# EAGLE board Progetto16sens (EAGLE 9.6.2)
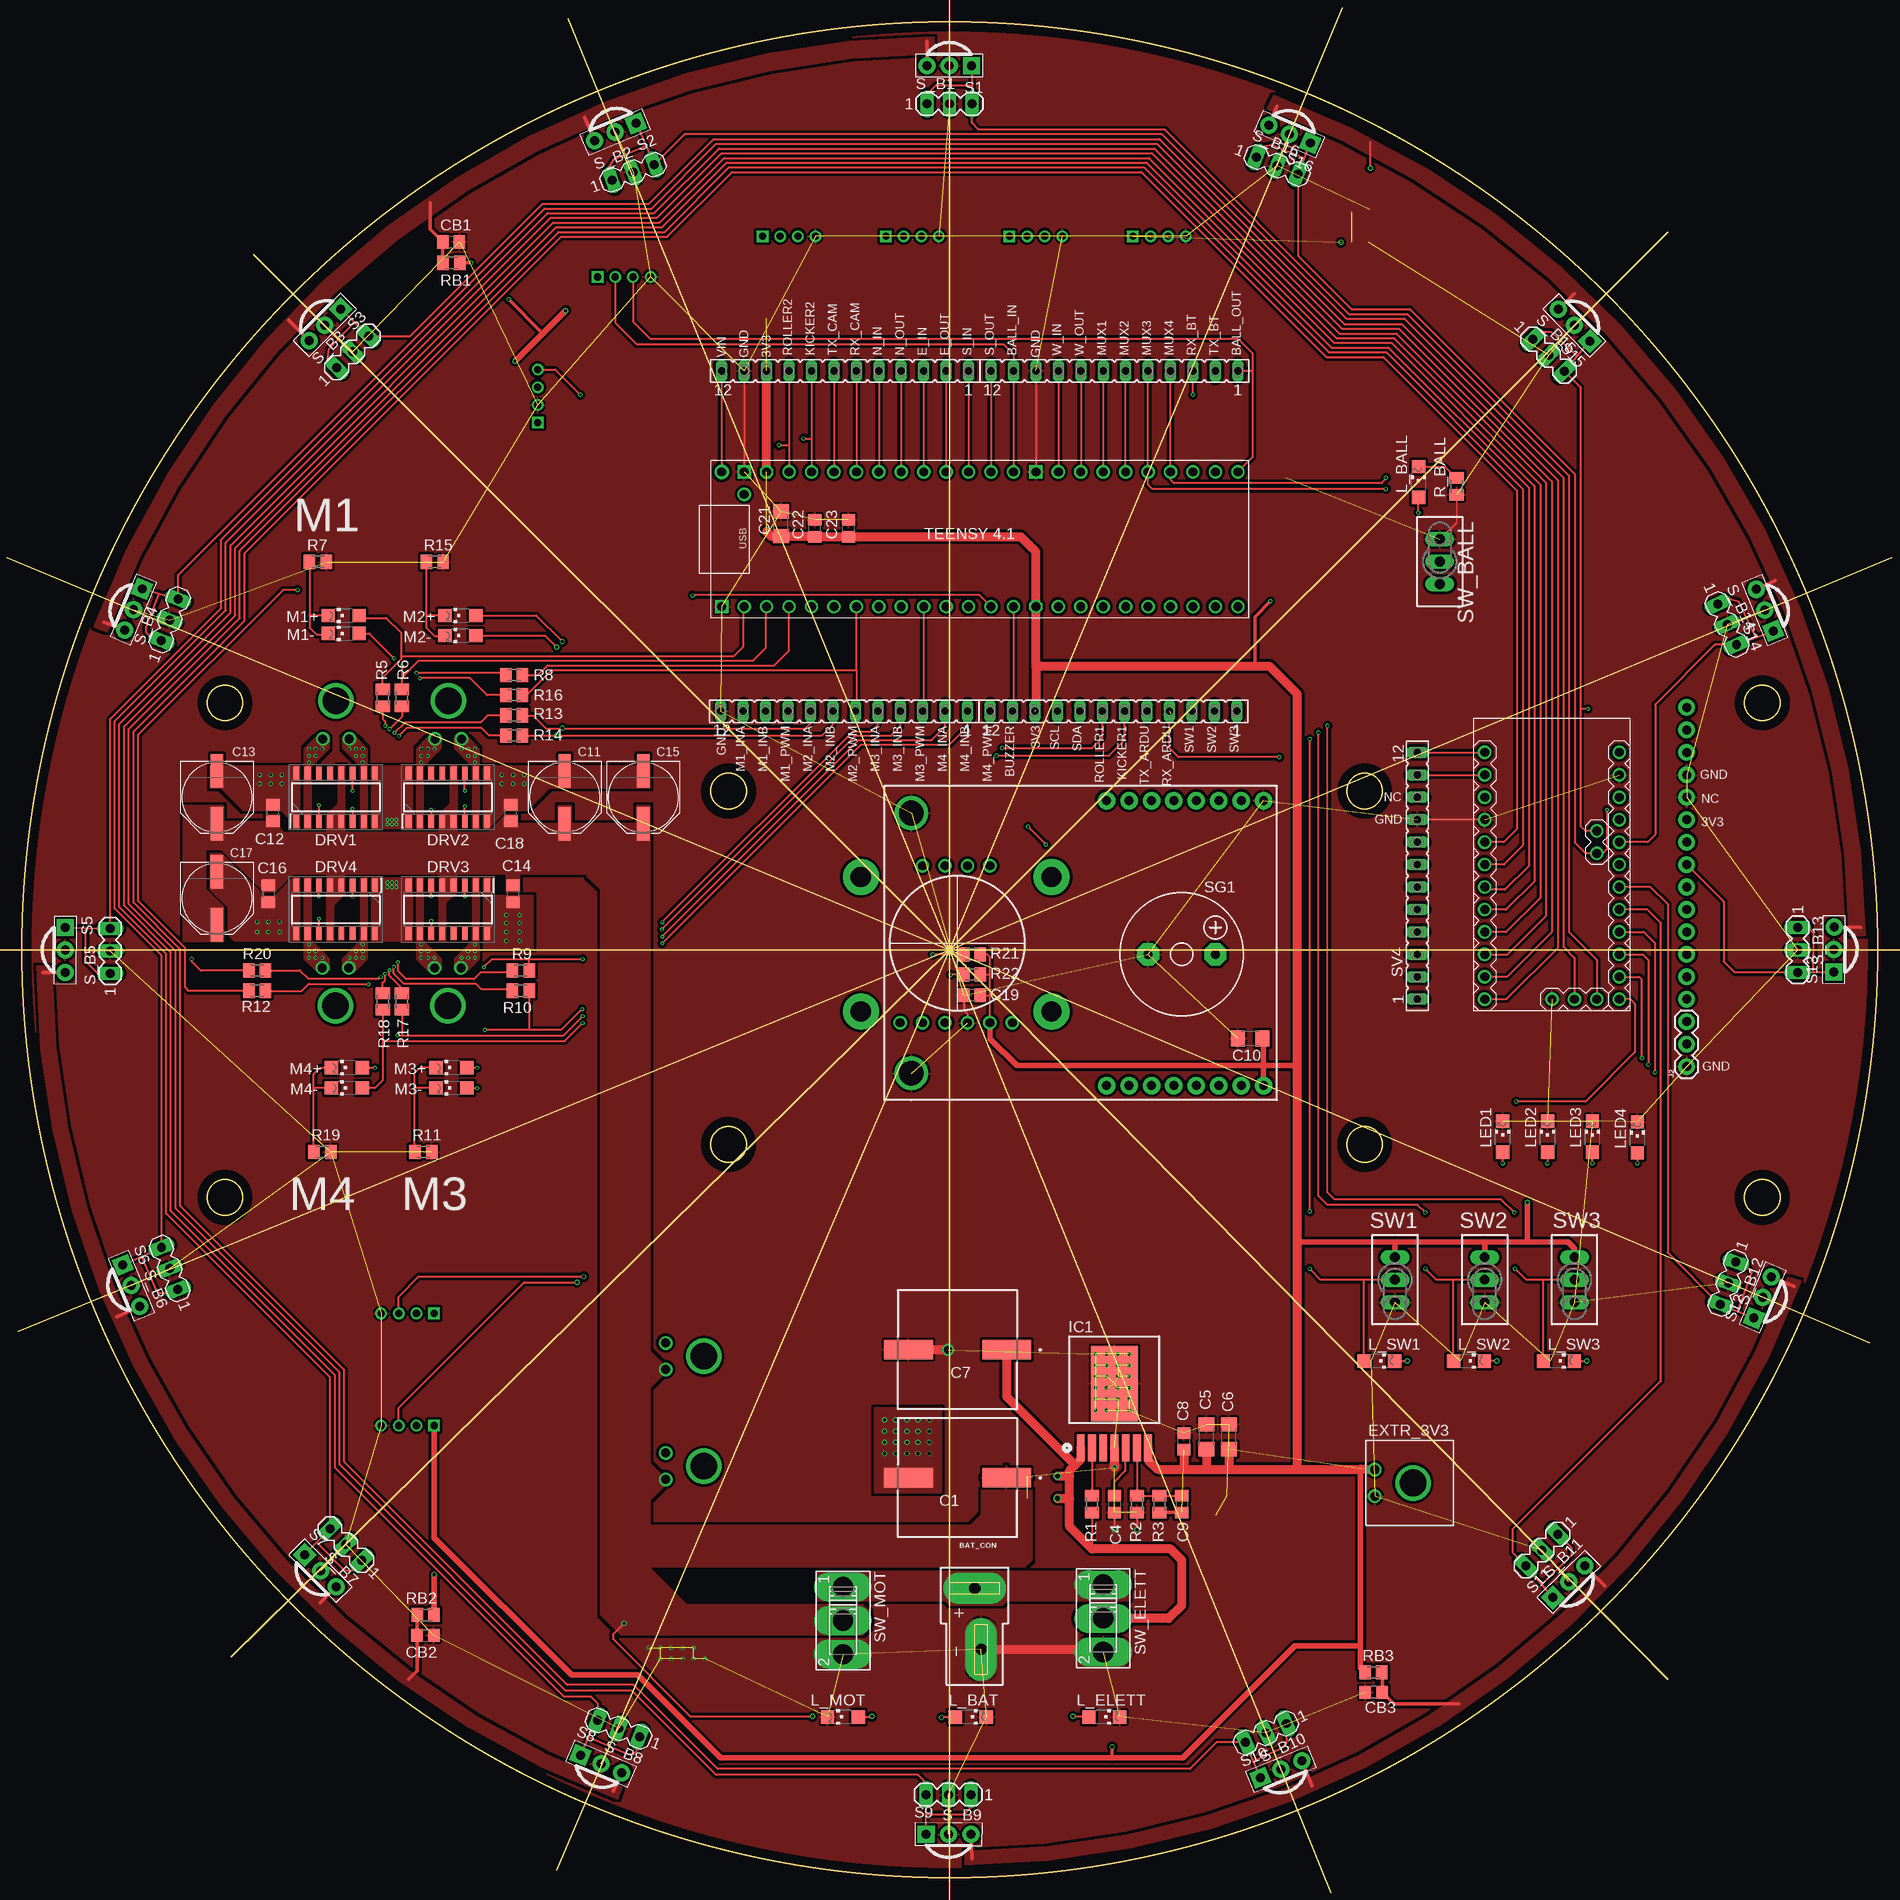
[diagram p2: board, top side]
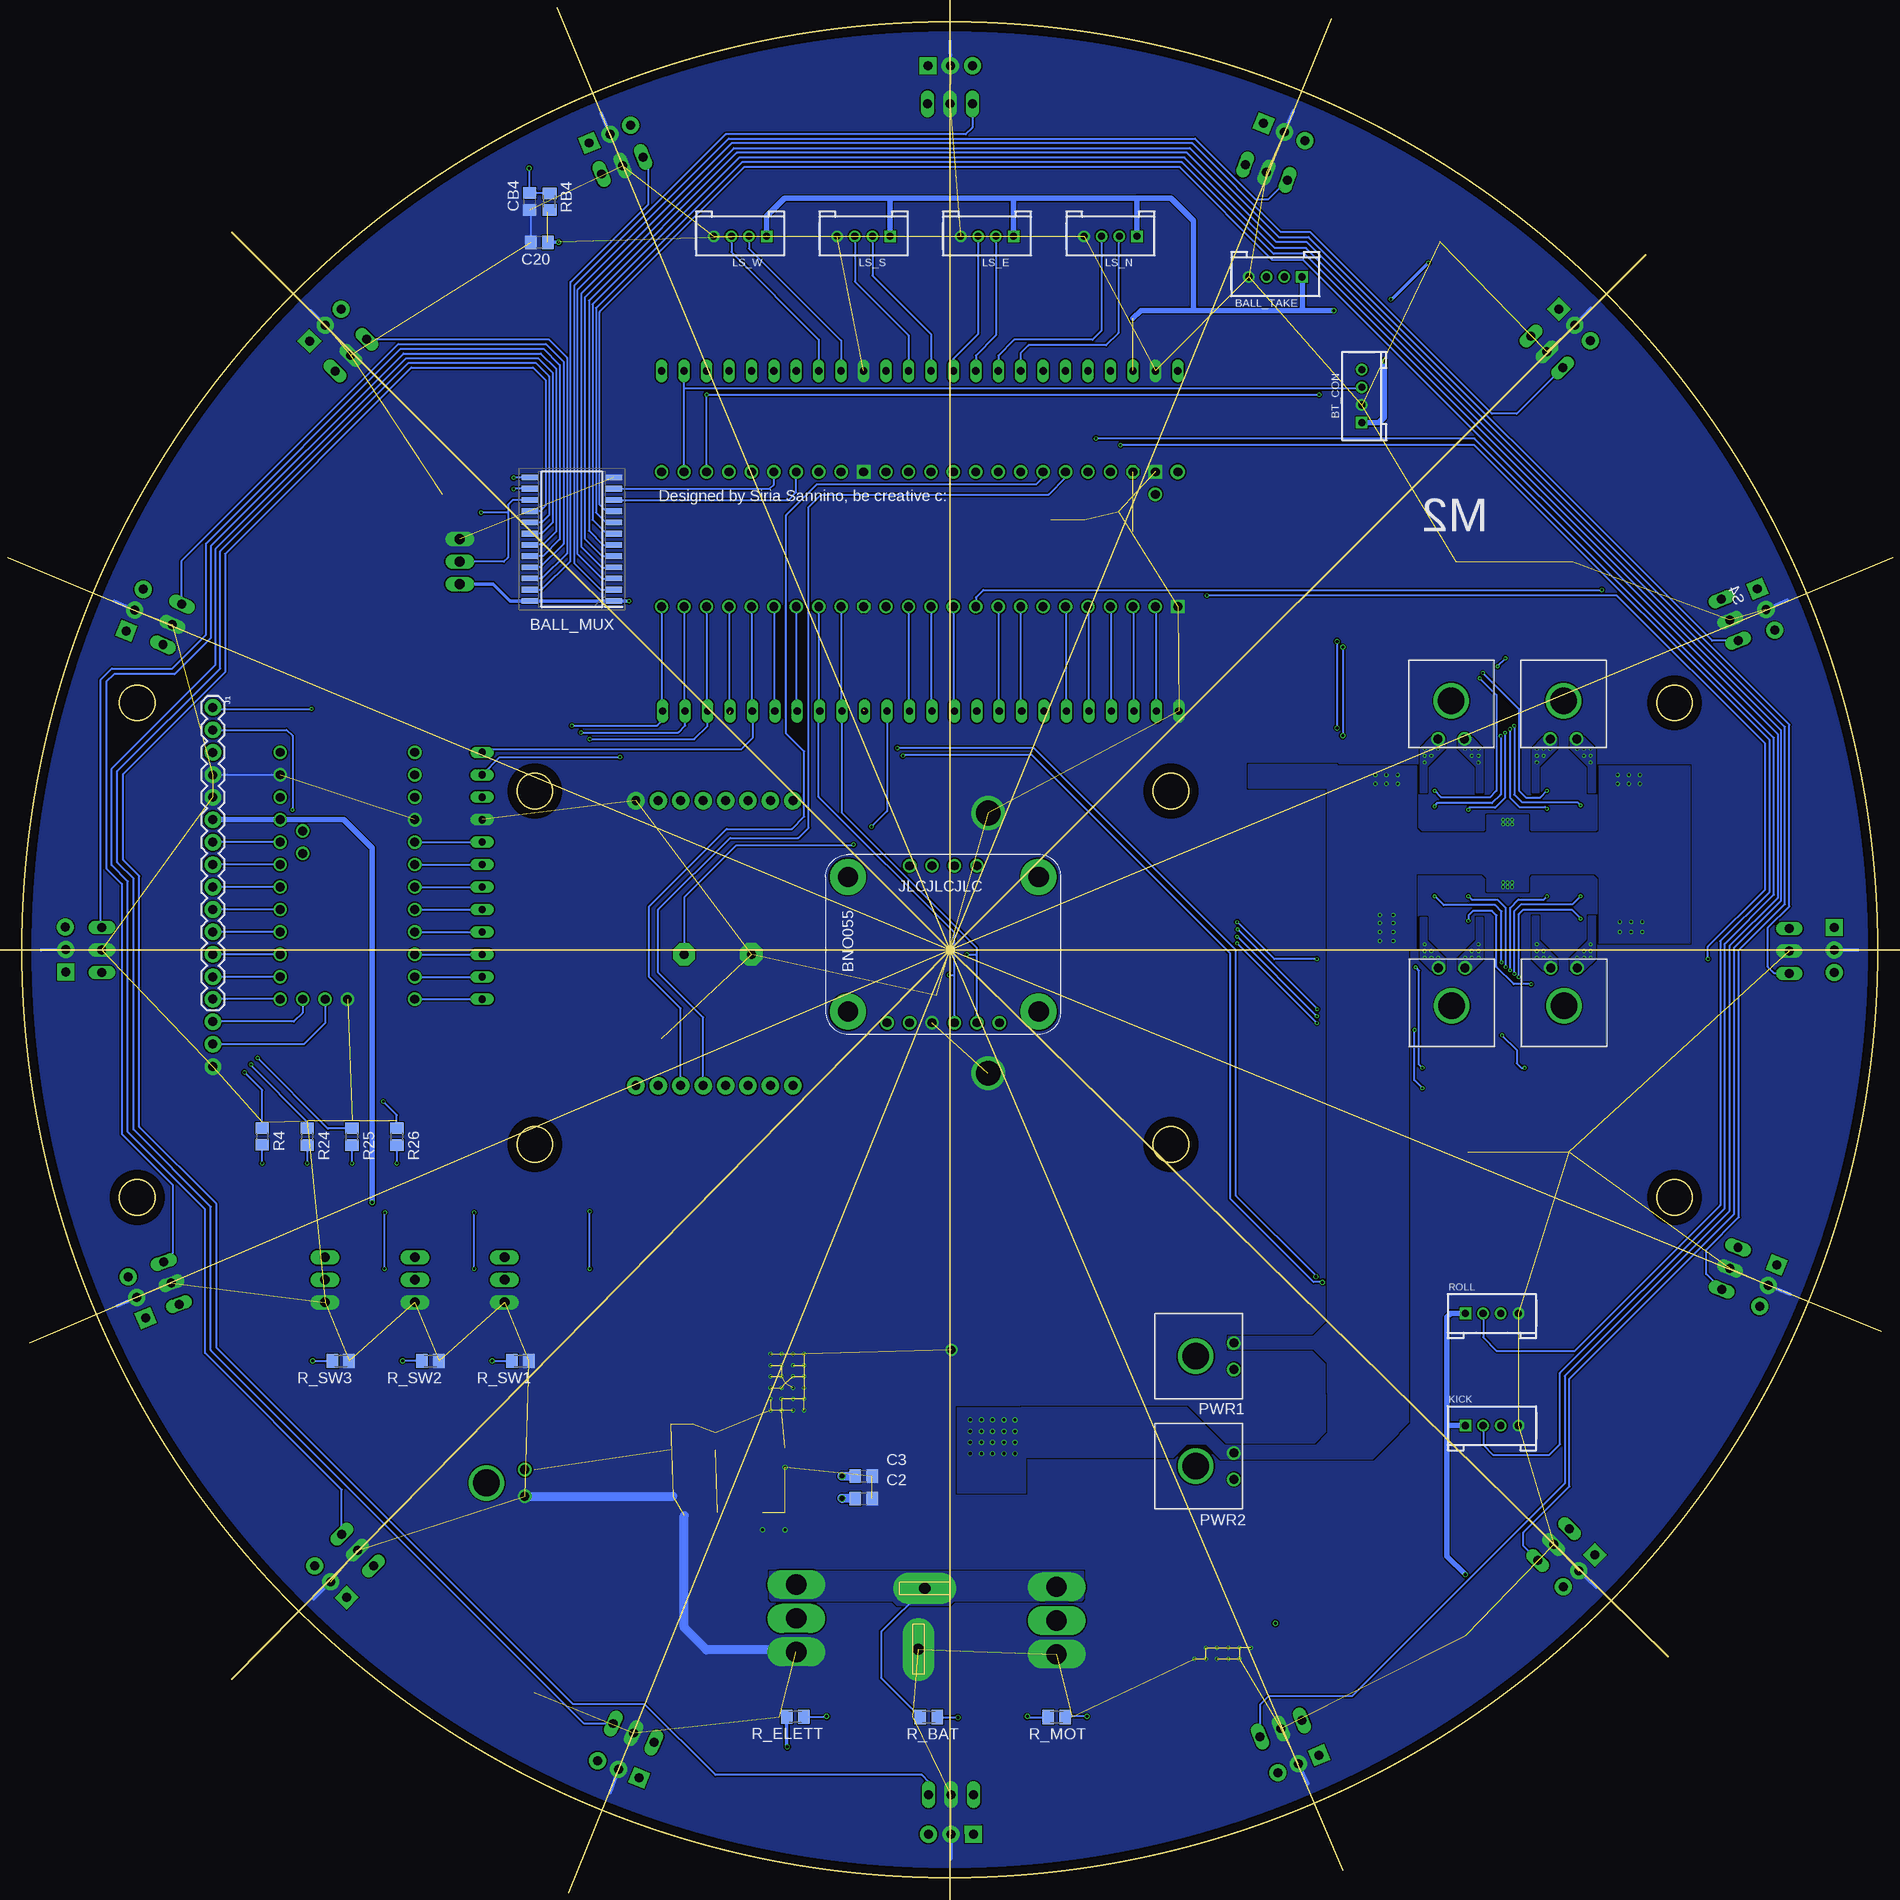
[diagram p3: board, bottom side, seen from below]

Size 210 x 210 mm. Coordinates in mm from the lower left corner, seen from the top.
Outline: circle at 105,105 radius 105
Outline: circle at 22.97,132.96 radius 2
Outline: circle at 22.97,76.96 radius 2
Outline: circle at 196.97,76.96 radius 2
Outline: circle at 196.97,132.96 radius 2
Outline: circle at 79.97,122.96 radius 2
Outline: circle at 79.97,82.96 radius 2
Outline: circle at 151.97,82.96 radius 2
Outline: circle at 151.97,122.96 radius 2
Copper layers (1*16): Top 0.035mm / dielectric 1.5mm / Bottom 0.035mm
Design rules "default *": minimum track width 6mil, minimum drill 0.35mm, track to track 6mil, track to pad 6mil, pad to pad 6mil, via to via 6mil, smd to smd 6mil, copper to edge 40mil, drill to drill 6mil, minimum pad ring 10mil, minimum via ring 4mil, stop-mask expansion 4mil, vias tented up to drill 0mil, thermal gap 10mil
Milling: 16 lines

## Footprints (pad centres in the part's own frame; a part is rotated, then mirrored left to right if it is on the bottom)
SOIC127P1030X265-24N = smd 1.95 x 0.65: 1 -4.725,6.985; 2 -4.725,5.715; 3 -4.725,4.445; 4 -4.725,3.175; 5 -4.725,1.905; 6 -4.725,0.635; 7 -4.725,-0.635; 8 -4.725,-1.905; 9 -4.725,-3.175; 10 -4.725,-4.445; 11 -4.725,-5.715; 12 -4.725,-6.985; 13 4.725,-6.985; 14 4.725,-5.715; 15 4.725,-4.445; 16 4.725,-3.175; 17 4.725,-1.905; 18 4.725,-0.635; 19 4.725,0.635; 20 4.725,1.905; 21 4.725,3.175; 22 4.725,4.445; 23 4.725,5.715; 24 4.725,6.985
HW4-2.0 = drill 0.8 pad 1.27 square: 1 -3,0 | drill 0.8 pad 1.27: 2 -1,0; 3 1,0; 4 3,0
DEANS = drill 1.27 pad 3.556 long: + 0,0; - 0.737,-6.921
FKV(H13) = smd 5.5 x 2.2: 1 -5.55,0; 2 5.55,0
C0805 = smd 1.3 x 1.5: 1 -0.95,0; 2 0.95,0
C1206 = smd 1.6 x 1.8: 1 -1.4,0; 2 1.4,0
PANASONIC_E = smd 3.8 x 1.4: + 3,0; - -3,0
SOIC127P600X175-16N = smd 1.525 x 0.65: 1 -2.712,4.445; 2 -2.712,3.175; 3 -2.712,1.905; 4 -2.712,0.635; 5 -2.712,-0.635; 6 -2.712,-1.905; 7 -2.712,-3.175; 8 -2.712,-4.445; 9 2.712,-4.445; 10 2.712,-3.175; 11 2.712,-1.905; 12 2.712,-0.635; 13 2.712,0.635; 14 2.712,1.905; 15 2.712,3.175; 16 2.712,4.445
43650-0200 = drill 1.02 pad 1.52: 1 0,0; 2 -3,0 | drill 3 pad 3: 3 -1.5,-4.32
NDW0007A = smd 0.89 x 3.06: 1 -3.81,0; 2 -2.54,0; 3 -1.27,0; 4 0,0; 5 1.27,0; 6 2.54,0; 7 3.81,0 | smd 5.35 x 8.54: 8 0,7.305
1X14 = drill 1.016 pad 1.88: 1 0,0; 2 2.54,0; 3 5.08,0; 4 7.62,0; 5 10.16,0; 6 12.7,0; 7 15.24,0; 8 17.78,0; 9 20.32,0; 10 22.86,0; 11 25.4,0; 12 27.94,0; 13 30.48,0; 14 33.02,0
1X03 = drill 1.016 pad 1.88: 1 0,0; 2 2.54,0; 3 5.08,0
2.0_1X4 = drill 0.8 pad 1.27 square: 1 -3,0 | drill 0.8 pad 1.27: 2 -1,0; 3 1,0; 4 3,0
CHIPLED_1206 = smd 1.5 x 1.5: A 0,-1.75; C 0,1.75
ARDUINO-PRO-MINI#NP = drill 1: J2.1 -1.27,5.08; J2.2 -3.81,5.08; J3.1 15.24,0; J3.2 15.24,2.54; J3.3 15.24,5.08; J6.1 -12.7,7.62; J6.2 -10.16,7.62; J6.3 -7.62,7.62; J6.4 -5.08,7.62; J6.5 -2.54,7.62; J6.6 0,7.62; J6.7 2.54,7.62; J6.8 5.08,7.62; J6.9 7.62,7.62; J6.10 10.16,7.62; J6.11 12.7,7.62; J6.12 15.24,7.62; J7.1 15.24,-7.62; J7.2 12.7,-7.62; J7.3 10.16,-7.62; J7.4 7.62,-7.62; J7.5 5.08,-7.62; J7.6 2.54,-7.62; J7.7 0,-7.62; J7.8 -2.54,-7.62; J7.9 -5.08,-7.62; J7.10 -7.62,-7.62; J7.11 -10.16,-7.62; J7.12 -12.7,-7.62
M0805 = smd 1.3 x 1.6: 1 -0.95,0; 2 0.95,0
R0805 = smd 1.3 x 1.5: 1 -0.95,0; 2 0.95,0
PNA460XM = drill 1.016 pad 1.93 square: 1 -2.54,0 | drill 1.016 pad 1.93: 2 0,0; 3 2.54,0
MA03-1 = drill 1.016 long: 1 -2.54,0; 2 0,0; 3 2.54,0
F/CM12P = drill 1.016 pad 2.54 octagon: + 3.81,0; - -3.81,0
FE12 = drill 0.813 long: 1 -13.97,0; 2 -11.43,0; 3 -8.89,0; 4 -6.35,0; 5 -3.81,0; 6 -1.27,0; 7 1.27,0; 8 3.81,0; 9 6.35,0; 10 8.89,0; 11 11.43,0; 12 13.97,0
TL3XPO = drill 1.1 pad 1.422 long: 1 -2.54,0; 2 0,0; 3 2.54,0
255SB = drill 2.286 pad 3.175 long: 1 -3.81,0; 2 0,0; 3 3.81,0
TEENSY41_EDIT = drill 1: 0/RX1 -25.4,-7.62; 1/TX1 -22.86,-7.62; 2 -20.32,-7.62; 3 -17.78,-7.62; 4 -15.24,-7.62; 5 -12.7,-7.62; 6 -10.16,-7.62; 7/RX2 -7.62,-7.62; 8/TX2 -5.08,-7.62; 9 -2.54,-7.62; 10/CS 0,-7.62; 11/MOSI 2.54,-7.62; 12/MISO 5.08,-7.62; 13(LED)/SCK 5.08,7.62; 14/A0/TX3 2.54,7.62; 15/A1/RX3 0,7.62; 16/A2/RX4/SCL1 -2.54,7.62; 17/A3/TX4/SDA1 -5.08,7.62; 18/A4/SDA -7.62,7.62; 19/A5/SCL -10.16,7.62; 20/A6/TX5 -12.7,7.62; 21/A7/RX5 -15.24,7.62; 22/A8 -17.78,7.62; 23/A9 -20.32,7.62; 24/A10/TX6/SCL2 10.16,-7.62; 25/A11/RX6/SDA2 12.7,-7.62; 26/A12/MOSI1 15.24,-7.62; 27/A13/SCK1 17.78,-7.62; 28/RX7 20.32,-7.62; 29/TX7 22.86,-7.62; 30 25.4,-7.62; 31 27.94,-7.62; 32 30.48,-7.62; 33 30.48,7.62; 34/RX8 27.94,7.62; 35/TX8 25.4,7.62; 36/CS 22.86,7.62; 37/CS 20.32,7.62; 38/A14/(CS1) 17.78,7.62; 39/A15/(MISO1) 15.24,7.62; 40/A16 12.7,7.62; 41/A17 10.16,7.62; VUSB -25.4,5.08 | drill 1 octagon: 3V3 7.62,-7.62; 3V3_1 -22.86,7.62 | drill 1 square: GND -27.94,-7.62; GND_1 7.62,7.62; GND_2 -25.4,7.62 | drill 1 pad 1.676: VIN -27.94,7.62
OPENMV_H7 = drill 1.016 pad 1.981: 3V3 1.651,1.524; BOOT 33.909,16.764; GND 33.909,1.524; P0 1.651,19.304; P1 1.651,16.764; P2 1.651,14.224; P3 1.651,11.684; P4 1.651,9.144; P5 1.651,6.604; P6 1.651,4.064; P7 33.909,6.604; P8 33.909,9.144; P9 33.909,11.684; RST 33.909,19.304; SYNC 33.909,14.224; VIN 33.909,4.064 | drill 2.794 pad 3.81: PAD1 3.048,41.402 | drill 2.794: PAD2 32.512,41.402
BNO055_BNO055 = drill 1: 3V3 9.525,1.27; ADR 17.145,19.05; GND 12.065,1.27; INT 14.605,19.05; PS0 9.525,19.05; PS1 12.065,19.05; RST 19.685,1.27; SCL 17.145,1.27; SDA 14.605,1.27; VIN 6.985,1.27 | drill 2.286 pad 4.064: PAD@1 2.54,17.78; PAD@2 24.13,17.78; PAD@3 2.54,2.54; PAD@4 24.13,2.54

## Placement (x,y rotation side)
BALL_MUX  CD74HC4067M  [SOIC127P1030X265-24N]  147.77,151.47 180 bottom
BALL_TAKE  4P-2.0  [HW4-2.0]  68.14,181.16 180 bottom
BAT_CON  [DEANS]  107.82,32.73 0 top
BT_CON  4P-2.0  [HW4-2.0]  58.36,167.67 90 bottom
C1  EEV-FK1C152Q  [FKV(H13)]  105.88,45.26 180 top
C2  100n  [C0805]  114.72,42.88 0 bottom
C3  100n  [C0805]  114.72,45.42 0 bottom
C4  22n  [C0805]  123.64,42.25 270 top
C5  100u  [C1206]  134.05,49.87 90 top
C6  100u  [C1206]  136.59,49.87 90 top
C7  EEV-FK1C152Q  [FKV(H13)]  105.88,59.74 180 top
C8  100n  [C0805]  131.51,49.36 90 top
C9  22n  [C0805]  131.26,42.25 270 top
C10  100u  [C1206]  139.01,94.95 180 top
C11  [PANASONIC_E]  61.41,122.26 270 top
C12  [C0805]  28.39,120.48 90 top
C13  [PANASONIC_E]  22.04,122.26 270 top
C14  [C0805]  55.57,111.34 270 top
C15  [PANASONIC_E]  70.3,122.26 270 top
C16  [C0805]  27.88,111.34 270 top
C17  [PANASONIC_E]  22.04,110.83 270 top
C18  [C0805]  55.31,120.48 90 top
C19  1u  [C0805]  107.51,99.85 180 top
C20  1u  [C0805]  151.45,185.07 180 bottom
C21  [C1206]  85.92,153.22 90 top
C22  [C0805]  89.73,152.71 90 top
C23  [C0805]  93.54,152.71 90 top
CB1  [C0805]  48.57,185.12 0 top
CB2  [C0805]  45.65,27.39 0 top
CB3  [C0805]  152.99,20.94 180 top
CB4  [C0805]  152.57,189.71 270 bottom
DRV1  VNH7070ASTR  [SOIC127P600X175-16N]  35.5,122.26 90 top
DRV2  VNH7070ASTR  [SOIC127P600X175-16N]  48.2,122.26 90 top
DRV3  VNH7070ASTR  [SOIC127P600X175-16N]  48.2,109.56 270 top
DRV4  VNH7070ASTR  [SOIC127P600X175-16N]  35.5,109.56 270 top
EXTR_3V3  43650-0201  [43650-0200]  153.1,46.16 90 top
IC1  LMZ14202TZE-ADJ_NOPB  [NDW0007A]  123.64,48.6 0 top
J1  [1X14]  188.41,132.42 270 bottom
J2  455-1750-1-ND  [1X03]  188.41,91.78 90 top
KICK  TWIG_2.0  [2.0_1X4]  43.63,51.14 0 bottom
L_BALL  [CHIPLED_1206]  158.06,157.95 0 top
L_BAT  [CHIPLED_1206]  107.38,18.16 270 top
L_ELETT  [CHIPLED_1206]  122.5,18.16 270 top
L_MOT  [CHIPLED_1206]  92.91,18.16 90 top
L_SW1  [CHIPLED_1206]  153.61,58.45 270 top
L_SW2  [CHIPLED_1206]  163.77,58.45 270 top
L_SW3  [CHIPLED_1206]  173.93,58.45 270 top
LED1  [CHIPLED_1206]  167.58,83.85 0 top
LED2  [CHIPLED_1206]  172.66,83.85 0 top
LED3  [CHIPLED_1206]  177.74,83.85 0 top
LED4  [CHIPLED_1206]  182.82,83.75 0 top
LS_E  4P-2.0  [HW4-2.0]  100.78,185.76 180 bottom
LS_N  4P-2.0  [HW4-2.0]  86.81,185.76 180 bottom
LS_S  4P-2.0  [HW4-2.0]  114.75,185.76 180 bottom
LS_W  4P-2.0  [HW4-2.0]  128.72,185.76 180 bottom
M1  43650-0201  [43650-0200]  37.03,128.86 180 bottom
M1+  [CHIPLED_1206]  36.39,142.83 90 top
M1-  [CHIPLED_1206]  36.39,140.8 90 top
M2  43650-0201  [43650-0200]  49.73,128.86 180 bottom
M2+  [CHIPLED_1206]  49.6,142.83 90 top
M2-  [CHIPLED_1206]  49.6,140.55 90 top
M3  43650-0201  [43650-0200]  46.68,102.96 0 bottom
M3+  [CHIPLED_1206]  48.58,91.65 90 top
M3-  [CHIPLED_1206]  48.58,89.37 90 top
M4  43650-0201  [43650-0200]  33.98,102.96 0 bottom
M4+  [CHIPLED_1206]  36.77,91.65 90 top
M4-  [CHIPLED_1206]  36.77,89.37 90 top
M5  ARDUINO-PRO-MINI  [ARDUINO-PRO-MINI#NP]  173.17,114.64 270 top
PWR1  43650-0201  [43650-0200]  72.84,57.49 270 bottom
PWR2  43650-0201  [43650-0200]  72.84,45.04 270 bottom
R1  61,9k  [M0805]  121.1,42.25 90 top
R2  1,07k  [M0805]  126.18,42.25 90 top
R3  3,32k  [M0805]  128.72,42.25 90 top
R4  [R0805]  182.82,83.88 270 bottom
R5  [M0805]  40.84,133.5 270 top
R6  [M0805]  43,133.5 270 top
R7  [M0805]  33.5,148.9 0 top
R8  [M0805]  55.7,136.1 0 top
R9  [M0805]  56.46,102.64 180 top
R10  [M0805]  56.46,100.36 180 top
R11  [M0805]  45.41,82.13 0 top
R12  [M0805]  26.61,100.36 180 top
R13  [M0805]  55.7,131.53 180 top
R14  [M0805]  55.7,129.25 180 top
R15  [M0805]  46.71,148.9 0 top
R16  [M0805]  55.7,133.82 0 top
R17  [M0805]  43,99.15 90 top
R18  [M0805]  40.84,99.15 90 top
R19  [M0805]  33.98,82.13 0 top
R20  [M0805]  26.61,102.64 180 top
R21  10k  [M0805]  107.51,104.48 0 top
R22  10k  [M0805]  107.51,102.19 0 top
R24  [R0805]  177.74,83.85 270 bottom
R25  [R0805]  172.66,83.85 270 bottom
R26  [R0805]  167.58,83.85 270 bottom
R_BALL  [M0805]  162.38,157.44 90 top
R_BAT  [M0805]  107.38,18.15 0 bottom
R_ELETT  [M0805]  122.5,18.19 180 bottom
R_MOT  [M0805]  92.91,18.15 0 bottom
R_SW1  [M0805]  153.61,58.45 180 bottom
R_SW2  [M0805]  163.77,58.45 180 bottom
R_SW3  [M0805]  173.93,58.45 180 bottom
RB1  [M0805]  48.6,182.74 180 top
RB2  [M0805]  45.68,29.71 180 top
RB3  [M0805]  152.96,23.2 0 top
RB4  [M0805]  150.31,189.68 90 bottom
ROLL  TWIG_2.0  [2.0_1X4]  43.63,63.84 0 bottom
S1  PNA460XM  [PNA460XM]  104.94,205.06 180 top
S2  PNA460XM  [PNA460XM]  67.13,197.56 202.5 top
S3  PNA460XM  [PNA460XM]  34.27,175.72 224.9 top
S4  PNA460XM  [PNA460XM]  12.61,143.51 247.4 top
S5  PNA460XM  [PNA460XM]  4.89,104.96 269.8 top
S6  PNA460XM  [PNA460XM]  12.37,66.98 292.3 top
S7  PNA460XM  [PNA460XM]  33.78,34.71 314.8 top
S8  PNA460XM  [PNA460XM]  65.53,12.85 337.2 top
S9  PNA460XM  [PNA460XM]  104.87,4.89 359.7 top
S10  PNA460XM  [PNA460XM]  142.5,12.23 22.2 top
S11  PNA460XM  [PNA460XM]  175.07,33.46 44.6 top
S12  PNA460XM  [PNA460XM]  197.01,65.64 67.1 top
S13  PNA460XM  [PNA460XM]  205.08,105.02 89.6 top
S14  PNA460XM  [PNA460XM]  197.25,143.44 112.1 top
S15  PNA460XM  [PNA460XM]  175.69,175.68 134.6 top
S16  PNA460XM  [PNA460XM]  143.46,197.31 157 top
S_B1  [MA03-1]  104.97,200.75 0 top
S_B2  [MA03-1]  69.16,193 20 top
S_B3  [MA03-1]  37.41,172.68 45 top
S_B4  [MA03-1]  16.71,142.33 68.2 top
S_B5  [MA03-1]  9.98,104.86 90 top
S_B6  [MA03-1]  16.71,68.92 111.5 top
S_B7  [MA03-1]  36.65,37.68 135 top
S_B8  [MA03-1]  67.51,16.85 158.5 top
S_B9  [MA03-1]  104.84,9.36 180 top
S_B10  [MA03-1]  140.78,16.34 205 top
S_B11  [MA03-1]  172.03,37.04 225 top
S_B12  [MA03-1]  193.11,67.27 250 top
S_B13  [MA03-1]  200.98,104.99 270 top
S_B14  [MA03-1]  192.98,141.82 295 top
S_B15  [MA03-1]  172.79,172.3 315 top
S_B16  [MA03-1]  142.06,193.76 338 top
SG1  F/CM12P  [F/CM12P]  131.26,104.48 0 top
SV1  [FE12]  93.05,132.01 180 top
SV2  [FE12]  123.53,132.01 180 top
SV3  [FE12]  123.64,170.52 180 top
SV4  [FE12]  157.93,113.37 90 top
SV6  [FE12]  93.16,170.52 180 top
SW1  TL32PO  [TL3XPO]  155.39,67.65 90 top
SW2  TL32PO  [TL3XPO]  165.55,67.65 90 top
SW3  TL32PO  [TL3XPO]  175.71,67.65 90 top
SW_BALL  TL38PO  [TL3XPO]  160.47,148.93 270 top
SW_ELETT  [255SB]  122.37,29.33 270 top
SW_MOT  [255SB]  92.91,29.07 270 top
U$1  TEENSY41_EDIT  [TEENSY41_EDIT]  107.13,151.47 0 top
U$2  OPENMV_H7  [OPENMV_H7]  142.06,87.97 90 top
U$3  BNO055_BNO055  [BNO055_BNO055]  119.07,95.46 0 bottom

## Tracks (layer width: path | path; a pad name or v marks a point on that pad's centre or on a via)
+3V3  (via drill 0.25, 0.35)  (7 unrouted)
  Top 0.254: U$3.3V3 109.54,99.75 | 109.54,99.75 109.54,102.17 | 109.54,102.17 109.54,104.2 109.26,104.48 R21.2 | R22.2 109.51,102.19 109.54,102.17 | C19.1 109.45,99.85 109.54,99.75
  Top 0.406: C9.2 R3.1 | v141.29,144.46 139.51,142.68 139.51,137.09 | RB1.1 v50.84,182.74 | RB2.1 46.64,29.72 | v55.06,178.62 58.87,174.81 58.87,174.68 | v123.39,14.79 123.39,13.52
  Top 0.61: C10.1 140.53,94.83 140.53,91.88 | U$3.3V3 109.54,94.93 112.59,91.88 140.53,91.88 | 140.53,91.88 U$2.3V3 | 140.53,91.88 143.96,91.88 144.34,92.26 | 144.34,71.94 155.39,71.94 | 155.39,71.94 165.55,71.94 | 165.55,71.94 170.38,71.94 | 170.38,71.94 174.95,71.94 175.71,71.18 SW3.3 | SW2.3 165.55,71.94 | SW1.3 155.39,71.94 | v170.38,76.38 170.38,71.94 | 151.5,46.19 151.5,26.22 | 151.5,26.22 151.5,23.71 RB3.1 | v46.64,34.28 46.64,29.72 | 151.5,26.22 144.09,26.22 131.39,13.52 123.39,13.52 79.06,13.52 69.67,22.92 62.17,22.92 46.63,38.46 KICK.1 | v55.82,171.63 58.87,174.68 v61.54,177.35
  Top 1.016: 131.5,46.19 128.55,46.19 127.45,47.28 IC1.7 | 131.5,46.19 134.06,46.19 | 134.06,46.19 136.59,46.19 | C8.1 131.51,46.2 131.5,46.19 | C5.1 134.05,46.19 134.06,46.19 | C6.1 136.59,46.19 | 136.59,46.19 144.34,46.19 | 144.34,46.19 151.5,46.19 | 151.96,46.19 153.07,46.19 EXTR_3V3.1 | 144.34,46.19 144.34,71.94 144.34,92.26 144.34,133.91 141.17,137.09 139.51,137.09 115.13,137.09 | 114.75,132.12 114.75,137.09 115.13,137.09 | 84.27,152.33 84.78,151.82 C21.1 89.67,151.82 C22.1 C23.1 113.03,151.76 113.99,150.81 114.75,150.04 U$1.3V3 114.75,137.47 115.13,137.09 | U$1.3V3_1 SV6.10
  Bottom 0.254: 150.5,188.54 RB4.1
  Bottom 0.406: SW_BALL.3 156.69,146.39 154.75,144.46 153.23,144.46 | 153.23,144.46 152.52,144.46 BALL_MUX.24 | v141.29,144.46 141.32,144.49 BALL_MUX.1 153.2,144.49 153.23,144.46 | C20.1 v149.27,185.07 | 46.64,51.13 KICK.1 | v50.84,182.74 54.96,178.62 v55.06,178.62 | R_ELETT.2 123.45,14.85 v123.39,14.79
  Bottom 0.61: v170.38,76.38 170.38,116.52 173.58,119.72 M5.J6.4 J1.6 | ROLL.1 48.3,63.84 48.71,63.43 48.71,51.14 | 48.71,51.14 48.71,36.34 v46.64,34.28 | KICK.1 48.71,51.14 | LS_W.1 125.72,188.05 123.72,190.05 111.7,190.05 | 111.7,190.05 97.86,190.05 | 97.86,190.05 83.89,190.05 | LS_E.1 97.78,189.97 97.86,190.05 | LS_S.1 111.75,190 111.7,190.05 | BALL_TAKE.1 65.09,181.11 65.09,177.35 | 65.09,177.35 77.41,177.35 | 77.41,177.35 77.41,187.51 79.95,190.05 83.89,190.05 | BT_CON.1 56.44,164.67 55.82,165.28 v55.82,171.63 | v61.54,177.35 65.09,177.35 | LS_N.1 83.81,189.97 83.89,190.05 | 77.41,177.35 83.38,177.35 84.27,176.46
+12V  (via drill 0.55)
  Top 0.254: R1.1 121.1,37.17
  Top 1.016: 119.2,46.7 118.56,46.06 118.56,45.44 | 119.2,46.7 119.83,47.33 IC1.1 | 118.56,42.88 118.56,39.71 121.1,37.17 129.99,37.17 131.26,35.9 131.26,30.82 129.77,29.33 SW_ELETT.2 | 118.56,42.88 118.56,45.44 | C7.1 111.43,54.46 119.2,46.7 | v117.2,45.42 117.21,45.44 118.56,45.44 | v117.2,42.91 117.23,42.88 118.56,42.88
  Bottom 1.016: C3.1 v117.2,45.42 | C2.1 117.17,42.88 v117.2,42.91
A_RX  (via drill 0.25)  (1 unrouted)
  Top 0.254: SV4.11 M5.J7.11 | SV2.4 129.86,131.99 129.86,127.82 130.88,126.8 v142.31,126.8
  Bottom 0.254: SV4.11 155.93,126.8 v142.31,126.8 | U$1.29/TX7 129.99,131.74
A_TX
  Top 0.254: SV4.12 M5.J7.12
  Bottom 0.254: SV2.5 127.34,131.63 | 127.34,131.63 127.34,128.94 128.56,127.72 157.55,127.72 SV4.12 | U$1.28/RX7 127.45,131.74 127.34,131.63
B1
  Top 0.254: M5.J3.3 178.25,103.82 175.07,106.99 175.07,158.68 156.79,176.97 150.18,176.97 129.33,197.82 108.27,197.82 107.51,198.58 107.51,200.21 | 107.51,200.21 S_B1.3 | S1.1 107.5,202.88 | 107.5,202.88 107.51,200.21 | S_B1.1 102.43,201.86 103.45,202.88 107.5,202.88
  Bottom 0.254: BALL_MUX.2 144.5,145.75 147.52,148.77 147.52,180.14 130.37,197.29 103.19,197.29 102.43,198.05 S_B1.1 | M5.J3.3 178.25,97.85 179.24,96.86 J2.3
B2
  Top 0.254: M5.J3.2 175.71,104.07 174.42,105.36 174.42,158.44 156.43,176.44 149.89,176.44 129.03,197.29 74.96,197.29 S_B2.3 70.61,195.99 | S2.1 70.61,195.99 | S_B2.1 66.36,193.48 67,194.49 70.61,195.99
  Bottom 0.254: BALL_MUX.3 143.07,147 144.34,147 147.11,149.76 147.11,179.72 130.03,196.81 77.24,196.81 70.39,189.95 68.95,189.95 S_B2.1 | M5.J3.2 175.71,96.7 178.12,94.29 188.38,94.29 J2.2
B3
  Top 0.254: M5.J7.1 168.03,99.4 173.82,105.2 173.82,158.16 156.15,175.82 149.68,175.82 128.75,196.75 78.28,196.75 70.96,189.44 58.9,189.44 43.93,174.48 S_B3.3 37.6,176.02 | S3.1 37.6,176.02 | S_B3.1 34.61,171.89 34.74,173.03 37.6,176.02
  Bottom 0.254: 157.27,99.4 SV4.1 M5.J7.1 | S_B3.1 40.83,165.67 43.63,165.67 64.2,186.24 67.51,186.24 77.54,196.27 129.71,196.27 146.7,179.28 146.7,150.63 144.34,148.27 143.07,148.27 BALL_MUX.4
B4
  Top 0.254: M5.J7.2 165.56,101.93 168.07,101.93 173.16,107.01 173.16,157.99 155.86,175.29 149.38,175.29 128.45,196.22 78.57,196.22 71.26,188.91 59.12,188.91 17.65,147.43 S_B4.3 15.5,145.3 | S4.1 15.5,145.3 | S_B4.1 14.42,140.52 14.04,140.9 14.04,141.53 15.5,145.3
  Bottom 0.254: S_B4.1 18.7,139.97 64.4,185.67 67.77,185.67 77.83,195.74 129.41,195.74 146.3,178.86 146.3,151.49 144.34,149.54 143.07,149.54 BALL_MUX.5 | M5.J7.2 SV4.2
B5
  Top 0.254: M5.J7.3 165.58,104.45 168.09,104.45 172.5,108.86 172.5,157.82 155.56,174.76 149.08,174.76 128.16,195.69 78.87,195.69 71.55,188.37 59.48,188.37 22.55,151.44 22.55,143.69 9.98,131.12 S_B5.3 7.18,107.45 | S5.1 7.18,107.45 | S_B5.1 9.88,102.42 8.45,102.42 7.18,103.69 7.18,107.45
  Bottom 0.254: S_B5.1 11.66,102.32 12.39,103.05 12.39,107.5 9.98,109.91 9.98,130.49 64.58,185.09 68.02,185.09 78.13,195.2 129.12,195.2 145.85,178.48 145.85,152.44 144.21,150.81 143.07,150.81 BALL_MUX.6 | M5.J7.3 SV4.3
B6
  Top 0.254: M5.J7.4 165.58,106.99 167.96,106.99 171.84,110.87 171.84,157.65 155.27,174.23 148.79,174.23 127.86,195.15 79.16,195.15 71.85,187.84 59.84,187.84 23.06,151.06 23.06,143.44 10.48,130.87 10.48,109.66 15.78,104.37 S_B6.3 13.53,70.28 | S6.1 13.53,70.28 | S_B6.1 16.45,66.1 15.56,66.1 15.18,66.48 13.53,70.28
  Bottom 0.254: S_B6.1 19.37,68.29 19.37,71.05 15.69,74.73 15.69,104.96 10.48,110.17 10.48,130.23 64.68,184.43 68.19,184.43 78.43,194.67 128.82,194.67 145.44,178.05 145.44,153.69 143.83,152.08 143.07,152.08 BALL_MUX.7 | M5.J7.4 SV4.4
B7
  Top 0.254: M5.J7.5 165.58,109.53 167.96,109.53 171.18,112.75 171.18,157.48 154.97,173.69 148.49,173.69 127.56,194.62 79.46,194.62 72.14,187.31 60.13,187.31 23.59,150.76 23.59,143.15 11.02,130.57 11.02,109.83 16.31,104.53 16.31,75.13 34.87,56.57 34.87,41.97 34.85,41.95 S_B7.3 33.33,37.91 | S7.1 33.33,37.91 | S_B7.1 37.29,34.73 36.52,34.73 33.33,37.91
  Bottom 0.254: S_B7.1 40.07,37.52 40.07,39.05 34.87,44.25 34.87,56.45 16.22,75.09 16.22,105.25 10.89,110.59 10.89,129.81 64.85,183.77 68.36,183.77 78.72,194.14 128.53,194.14 145.04,177.63 145.04,154.49 143.9,153.35 143.07,153.35 BALL_MUX.8 | M5.J7.5 SV4.5
B8
  Top 0.254: M5.J7.6 165.83,111.82 167.84,111.82 170.52,114.5 170.52,157.31 154.68,173.16 148.2,173.16 127.27,194.09 79.75,194.09 72.44,186.77 60.43,186.77 24.12,150.47 24.12,142.85 11.55,130.28 11.55,109.99 16.84,104.7 16.84,75.43 35.4,56.87 35.4,46.41 61.36,20.45 64.38,20.45 65.14,19.69 65.14,17.96 | 65.14,17.96 S_B8.3 | S8.1 64.14,15.84 | 64.14,15.84 64.26,16.09 65.14,17.96 | S_B8.1 69.79,15.84 69.79,14.53 69.16,13.9 68.65,13.9 64.14,15.84
  Bottom 0.254: BALL_MUX.9 143.9,154.65 144.63,155.38 144.63,177.21 128.23,193.61 79.02,193.61 68.52,183.11 65.02,183.11 11.3,129.39 11.3,110.88 16.76,105.42 16.76,75.38 35.4,56.74 35.4,44.61 59.51,20.5 68.9,20.5 69.87,19.54 S_B8.1 | M5.J7.6 SV4.6
B9
  Top 0.254: S_B9.3 102.3,9.58 | 102.3,9.58 102.3,10.73 101.42,11.61 78.56,11.61 69.03,21.14 61.54,21.14 35.93,46.74 35.93,57.16 17.38,75.72 17.38,104.86 12.08,110.16 12.08,129.98 24.66,142.55 24.66,150.17 60.72,186.24 72.73,186.24 80.05,193.55 126.97,193.55 147.9,172.62 154.4,172.62 169.86,157.16 169.86,116.77 167.73,114.64 M5.J7.7 | S9.1 102.32,7.17 | 102.32,7.17 102.3,9.58 | 102.32,7.17 106.62,7.17 107.38,7.93 S_B9.1
  Bottom 0.254: S_B9.1 107.38,10.85 108.15,11.61 131.51,11.61 139.51,19.62 147.64,19.62 187.98,59.96 187.98,76.21 196.72,84.95 196.72,113.34 198.55,115.17 198.55,124.91 187.04,136.42 187.04,149.8 165.94,170.89 152.18,170.89 150.77,169.48 150.77,155.25 151.37,154.65 BALL_MUX.16 | M5.J7.7 SV4.7
B10
  Top 0.254: M5.J7.8 167.71,117.18 169.2,118.67 169.2,157 154.1,172.09 147.61,172.09 126.68,193.02 80.34,193.02 73.03,185.71 61.02,185.71 25.19,149.88 25.19,142.26 12.62,129.69 12.62,110.33 17.91,105.03 17.91,76.02 36.47,57.46 36.47,47.04 61.71,21.8 69.2,21.8 78.72,12.27 132.19,12.27 135.18,15.27 S_B10.3 139.39,13.14 | S_B10.1 143.09,15.19 142.44,14.53 139.39,13.14 | S10.1 139.39,13.14
  Bottom 0.254: S_B10.1 146.39,17.42 188.64,59.66 188.64,75.92 197.38,84.66 197.38,113.04 199.21,114.88 199.21,125.2 187.57,136.84 187.57,150.09 166.24,171.43 151.89,171.43 150.36,169.9 150.36,154.18 151.2,153.35 152.47,153.35 BALL_MUX.17 | M5.J7.8 SV4.8
B11
  Top 0.254: S_B11.3 170.06,35.42 | 170.06,35.42 168.72,36.75 168.72,39.43 185.49,56.19 185.49,108.01 183.94,109.56 M5.J6.8 | S11.1 172,33.15 | 172,33.15 170.06,35.42 | S_B11.1 175.33,37.33 175.33,36.47 172,33.15
  Bottom 0.254: BALL_MUX.18 152.52,152.08 151.2,152.08 149.95,153.32 149.95,170.32 151.59,171.96 166.53,171.96 188.11,150.39 188.11,137.26 199.87,125.5 199.87,114.58 198.04,112.75 198.04,84.36 189.3,75.62 189.3,59.37 173.82,43.89 S_B11.1 | M5.J6.8 J1.10
B12
  Top 0.254: M5.J6.7 184.32,112.1 186.25,110.17 186.25,70.72 192.09,64.88 | S_B12.3 192.09,64.88 | S12.1 194.91,63.75 194.12,64.07 | 194.12,64.07 193.82,64.19 192.09,64.88 | S_B12.1 194.63,69.66 195.78,68.51 194.12,64.07
  Bottom 0.254: S_B12.1 192.96,70.67 192.96,78.4 198.7,84.13 198.7,112.45 200.45,114.2 200.45,135.34 199.59,136.2 192.73,136.2 188.64,140.29 188.64,150.69 166.83,172.49 151.3,172.49 149.55,170.75 149.55,152.33 151.04,150.84 BALL_MUX.19 | M5.J6.7 J1.9
B13
  Top 0.254: S13.1 205.03,102.45 202.76,102.45 | 202.76,102.45 S_B13.3 193.84,102.45 192.6,103.69 192.6,110.45 J1.8 | 202.76,102.45 202.76,104.53 202.79,104.56 202.79,106.84 202.1,107.53 S_B13.1
  Bottom 0.254: BALL_MUX.20 151.04,149.56 149.14,151.47 149.14,171.17 151,173.03 167.13,173.03 189.17,150.98 189.17,140.65 192.98,136.84 199.84,136.84 201.11,135.57 201.11,107.66 S_B13.1 | M5.J6.6 J1.8
B14
  Top 0.254: M5.J6.5 183.99,117.18 184.85,118.04 184.85,132.77 191.6,139.52 S_B14.3 196.25,140.35 | 196.25,140.35 S14.1 | S_B14.1 193.36,144.71 194.25,144.46 196.25,140.35
  Bottom 0.254: S_B14.3 193.92,139.38 | S_B14.1 191.91,149.07 167.42,173.56 150.7,173.56 148.74,171.59 148.74,150.93 151.37,148.3 BALL_MUX.21 | M5.J6.5 J1.7
B15  (via drill 0.2)
  Top 0.254: 176.4,132.26 176.4,168.69 S_B15.3 176.04,172.2 | 176.4,132.26 176.4,119 176.92,118.48 | 176.92,118.48 176.95,118.45 | 176.92,118.48 178.22,118.48 M5.J2.2 | v177.23,132.26 176.4,132.26 | 176.04,172.2 S15.1 | S_B15.1 171.9,174.94 173.04,174.94 176.04,172.2
  Bottom 0.254: S_B15.3 174.84,170.5 | S_B15.1 150.41,174.09 148.33,172.01 148.33,149.87 151.17,147.03 BALL_MUX.22 | J1.1 188.25,132.26 v177.23,132.26
B16  (via drill 0.2)
  Top 0.254: 176.98,115.91 176.93,115.96 | 176.93,115.96 175.74,117.16 175.74,158.85 157.08,177.5 150.48,177.5 144.41,183.57 S_B16.3 145.12,194.61 | J1.2 188.38,129.86 | 176.93,115.96 178.2,115.96 M5.J2.1 178.91,115.91 179.39,116.39 v179.39,120.83 | 145.12,194.61 S16.1 | S_B16.1 140.28,195.89 141.42,196.15 145.12,194.61
  Bottom 0.254: S_B16.1 139.13,194.15 139.13,189.35 147.92,180.56 147.92,149 151.17,145.75 BALL_MUX.23 152.47,145.73 | J1.2 180.06,129.88 179.39,129.22 v179.39,120.83
BALL_IN
  Top 0.254: BALL_TAKE.2 67.14,175.95 69.55,173.54 111.07,173.54 112.21,172.4 SV3.11 U$1.13(LED)/SCK
BALL_OUT
  Top 0.254: BALL_TAKE.3 69.14,176.09 71.06,174.17 137.61,174.17 139.26,172.52 139.26,170.49 | 139.26,170.49 139.26,160.74 U$1.33 | SV3.1 139.23,170.52 139.26,170.49
BT_RX  (via drill 0.25)
  Top 0.254: BT_CON.4 60.34,170.67 v63.19,167.82 | v132.53,167.82 SV3.3
  Bottom 0.254: U$1.35/TX8 v132.53,167.82 v63.19,167.82
BT_TX
  Bottom 0.254: 135.07,168.54 58.49,168.54 BT_CON.3 | 135.07,168.54 SV3.2 | U$1.34/RX8 135.07,168.54
BUZZ  (via drill 0.25)
  Top 0.254: v113.86,118.93 v115.89,116.9 | U$1.12/MISO 112.21,132.12 SV2.11
  Bottom 0.254: SV2.11 112.1,120.69 v113.86,118.93 | v115.89,116.9 115.97,116.82 129.17,116.82 135.07,110.92 SG1.+
CAM_RX
  Top 0.254: SV6.6 U$1.20/A6/TX5
  Bottom 0.254: U$2.P5 135.45,98.36 139.01,101.91 139.01,109.91 130.24,118.67 122.88,118.67 121.48,120.07 121.48,127.44 123.51,129.47 123.51,154.18 120,157.69 95.19,157.69 94.43,158.45 U$1.20/A6/TX5
CAM_TX
  Top 0.254: SV6.7 U$1.21/A7/RX5
  Bottom 0.254: U$2.P4 132.91,97.34 137.99,102.42 137.99,109.53 129.86,117.66 122.12,117.66 120.97,118.8 120.97,155.12 119.58,156.52 93.8,156.52 91.89,158.43 U$1.21/A7/RX5
E_IN
  Top 0.254: SV6.3 U$1.17/A3/TX4/SDA1
  Bottom 0.254: LS_E.2 99.78,174.54 102.05,172.27 SV6.3
E_OUT
  Top 0.254: SV6.2 U$1.16/A2/RX4/SCL1
  Bottom 0.254: LS_E.3 101.78,174.7 104.59,171.89 SV6.2
ENABLE  (via drill 0.25)
  Top 0.254: v158.06,154.49 L_BALL.A
  Bottom 0.254: BALL_MUX.15 154.47,155.92 155.01,155.38 155.01,154.49 | 155.01,154.49 155.01,149.41 155.49,148.93 SW_BALL.2 | 155.01,154.49 v158.06,154.49
GND  (via drill 0.25, 0.35, 0.9)  (127 unrouted)
  Top 0.152: R_BALL.1 162.38,153.38 SW_BALL.1
  Top 0.254: C4.2 v123.64,39.33 | R2.1 v126.18,39.33 | C19.2 106.62,99.79 106.62,98.13 107,97.75 U$3.GND | SV6.11 U$1.GND_2 | SV3.10 U$1.GND_1 | M5.J7.9 SV4.9
  Top 1.016: IC1.4 123.64,46.87 123.62,46.85 123.62,46.45 v123.66,46.42 | C7.2 v104.82,59.74 v104.82,59.73 | BAT_CON.- 122.08,25.81 SW_ELETT.3
  Bottom 0.254: C20.2 152.4,188.6 CB4.2 | M5.J6.2 J1.4
  Bottom 0.406: S2.2 66.11,199.95 | S3.2 32.45,177.6 | S4.2 10.23,144.58 | S5.2 2.23,104.96 | S6.2 9.85,65.97 | S7.2 31.82,32.82 | S8.2 64.46,10.6 | S9.2 104.84,2.09 | S10.2 143.45,9.58 | S11.2 176.98,31.55 | S12.2 199.2,64.7 | S13.2 207.84,104.96 | S14.2 199.59,144.46 | S15.2 177.36,177.35 | S16.2 144.47,199.7 | S1.2 104.97,207.83
  Bottom 1.016: SW_ELETT.3 122.59,25.74 132.53,25.74 135.07,28.28 135.07,40.98 | EXTR_3V3.2 136.36,43.16 136.34,43.14
  other vias: 70.94,25.99 72.21,25.99 73.48,25.99 74.75,25.99 76.02,25.99 72.21,24.72 73.48,24.72 74.75,24.72 76.02,24.72 77.28,24.72 121.48,59.24 122.75,59.24 124.02,59.24 125.29,59.24 121.48,57.97 122.75,57.97 124.02,57.97 125.29,57.97 121.48,56.7 122.75,56.7 124.02,56.7 125.29,56.7 121.48,55.43 122.75,55.43 124.02,55.43 125.29,55.43 121.48,54.16 122.75,54.16 124.02,54.16 125.29,54.16 121.48,52.89 122.75,52.89 124.02,52.89 125.29,52.89
  pour Bottom (rank 2, no thermals): 138.12,62.32 138.12,38.44 95.19,38.44 95.19,62.32
  pour Top (no thermals): 124.91,27.01 125.67,26.25 125.67,24.85 124.66,23.84 110.94,23.84 109.29,22.18 108.02,22.18 106.5,23.71 71.32,23.71 68.01,27.01 105.35,27.01 107.51,29.17 109.54,29.17 111.7,27.01
  pour Bottom (no thermals): 68.01,27.01 71.32,23.71 106.5,23.71 108.02,22.18 109.29,22.18 110.94,23.84 124.66,23.84 125.67,24.85 125.67,26.25 124.91,27.01 111.7,27.01 109.54,29.17 107.51,29.17 105.35,27.01
  pour Bottom (rank 2, no thermals): 104.97,208.46 arc90 1.34,104.96 arc90 104.97,1.45 arc90 208.6,104.96 arc90
  pour Bottom (rank 2, no thermals): 206.82,104.96 arc90 104.97,206.56 arc90 3.12,104.71 arc90 104.72,2.72 arc90
  pour Bottom (isolate 0.305, rank 2): 104.97,212.91 arc90 -2.98,104.96 arc90 104.97,-2.99 arc90 212.92,104.96 arc90
  pour Top (isolate 0.305, rank 2): -1.71,104.96 arc-90 104.97,211.64 arc-90 211.65,104.96 arc-90 104.97,-1.72 arc-90
K_DIG  (via drill 0.25, 0.35)
  Top 0.254: KICK.3 42.63,53.16 56.84,67.37 v62.81,67.37 | v110.31,126.95 123.03,126.95 124.8,128.72 SV2.6
  Bottom 0.254: v62.81,67.37 62.83,67.39 63.82,67.39 73.25,76.81 73.25,104.6 95.7,127.06 110.2,127.06 v110.31,126.95 | U$1.27/A13/SCK1 124.91,132.12 SV2.6
K_PWM  (via drill 0.25)
  Top 0.254: SV6.8 89.35,162.87 | 89.35,162.87 U$1.22/A8 | v88.46,162.87 89.35,162.87
  Bottom 0.254: KICK.2 44.63,48.94 43.5,47.81 37.15,47.81 35.93,49.03 35.93,57.1 17.29,75.74 17.29,105.65 11.7,111.24 11.7,128.97 45.61,162.87 v88.46,162.87
LED1  (via drill 0.25)
  Top 0.254: v169.11,87.81 176.98,87.81 182.57,93.4 182.57,98.86 182.03,99.4 M5.J6.12
  Bottom 0.254: 167.65,84.73 R26.1 167.58,86.29 v169.11,87.81 | M5.J6.12 J1.14
LED2  (via drill 0.25)
  Top 0.254: M5.J6.11 183.05,101.94 183.33,101.66 v183.33,92.73
  Bottom 0.254: v183.33,92.73 175.33,84.73 175.33,84.8 R25.1 | M5.J6.11 J1.13
LED3  (via drill 0.25)
  Top 0.254: M5.J6.10 183.43,104.48 184.09,103.82 v184.09,92
  Bottom 0.254: v184.09,92 184.09,91.88 177.74,85.53 R24.1 | M5.J6.10 J1.12
LED4  (via drill 0.25)
  Top 0.254: M5.J6.9 183.56,107.02 184.83,105.75 v184.83,91.12
  Bottom 0.254: R4.1 182.82,89.11 v184.83,91.12 | M5.J6.9 J1.11
M1_INA
  Top 0.254: 81.73,132.12 SV1.11 | R5.1 40.84,135.82 42.89,137.88 42.89,138.26 | 42.89,138.26 80.59,138.26 81.6,139.27 81.6,143.72 U$1.0/RX1 | M1+.A 38.42,142.55 41.22,142.55 42.89,140.88 42.89,138.26
  Bottom 0.254: SV1.11 81.62,143.74 U$1.0/RX1
M1_INB  (via drill 0.2)
  Top 0.254: R6.1 43,135.82 | U$1.1/TX1 84.14,143.72 84.14,139.12 82.75,137.72 44.9,137.72 43,135.82 | M1-.A 39.28,140.8 v42.11,137.98 | v43,137.09 43,135.82
  Bottom 0.254: v43,137.09 v42.11,137.98 | SV1.10 84.16,143.74 U$1.1/TX1
M1_OUTA  (via drill 0.2 pad 0.05)
  other vias: 32.45,127.72 33.22,127.72 33.98,127.72 32.45,126.96 33.22,126.96 32.45,126.2
  pour Top (no thermals): 31.95,118.7 32.71,118.7 32.71,125.82 34.74,127.85 34.74,128.99 33.22,128.99 31.95,127.72
  pour Bottom (no thermals): 31.95,122.77 32.71,122.77 32.71,125.82 34.74,127.85 34.74,128.99 33.22,128.99 31.95,127.72
M1_OUTB  (via drill 0.2 pad 0.05)
  other vias: 37.03,127.72 37.79,127.72 38.55,127.72 38.55,126.96 37.79,126.96 38.55,126.2
  pour Top (no thermals): 38.3,118.7 39.06,118.7 39.06,127.72 37.79,128.99 36.26,128.99 36.26,127.85 38.3,125.82
  pour Bottom (no thermals): 38.3,122.77 39.06,122.77 39.06,127.72 37.79,128.99 36.26,128.99 36.26,127.85 38.3,125.82
M1_PWM
  Top 0.254: R8.2 58.33,136.1 58.36,136.07 59.48,137.19 85.13,137.19 86.81,138.87 U$1.2
  Bottom 0.254: SV1.9 86.7,143.74 U$1.2
M2_INA  (via drill 0.35)
  Top 0.254: R13.1 56.67,131.5 57.85,131.5 59.32,130.03 61.16,130.03 | SV1.8 89.24,130.63 88.64,130.03 61.16,130.03 | M2+.A 58.21,142.83 v61.16,139.88 | v61.16,130.11 61.16,130.03
  Bottom 0.254: SV1.8 89.24,143.74 U$1.3 | v61.16,139.88 v61.16,130.11
M2_INB  (via drill 0.35)
  Top 0.254: R14.1 v60.52,129.25 90.52,129.25 91.78,130.5 SV1.7 | M2-.A 59.22,140.55 v60.52,139.25
  Bottom 0.254: SV1.7 91.78,143.74 U$1.4 | v60.52,139.25 v60.52,129.25
M2_OUTA  (via drill 0.2 pad 0.05)
  other vias: 45.15,126.2 45.15,126.96 45.92,126.96 45.15,127.72 45.92,127.72 46.68,127.72
  pour Top (no thermals): 44.65,118.7 45.41,118.7 45.41,125.82 47.44,127.85 47.44,128.99 45.92,128.99 44.65,127.72
  pour Bottom (no thermals): 44.65,122.77 45.41,122.77 45.41,125.82 47.44,127.85 47.44,128.99 45.92,128.99 44.65,127.72
M2_OUTB  (via drill 0.2 pad 0.05)
  other vias: 49.73,127.72 50.49,127.72 51.25,127.72 51.25,126.96 51.25,126.2 50.49,126.96
  pour Top (no thermals): 51,118.7 51.76,118.7 51.76,127.72 50.49,128.99 48.96,128.99 48.96,127.85 51,125.82
  pour Bottom (no thermals): 51,122.77 51.76,122.77 51.76,127.72 50.49,128.99 48.96,128.99 48.96,127.85 51,125.82
M2_PWM
  Top 0.254: R16.2 57.12,133.82 59.96,136.66 94.43,136.66 | 94.43,136.66 U$1.5 | 94.43,136.66 94.43,132.12 SV1.6
M3_INA  (via drill 0.2)
  Top 0.254: 57.44,102.67 R9.1 57.41,103.88 57.35,103.94 | M3+.A 51.48,91.65 v51.5,91.62 | v52.27,103.03 53.18,103.94 57.35,103.94 | 57.35,103.94 v63.44,103.94 | v72.46,108.13 94.05,129.72 96.08,129.72 96.86,130.5 SV1.5
  Bottom 0.254: v51.5,91.62 51.89,92 51.89,102.65 v52.27,103.03 | v63.44,103.94 68.27,103.94 v72.46,108.13 | U$1.6 96.97,132.12 SV1.5
M3_INB  (via drill 0.2)
  Top 0.254: M3-.A 51.48,89.37 v51.5,89.34 | v63.39,98.28 61.03,95.92 61.01,95.94 57.41,95.94 | v72.41,107.3 94.33,129.22 98.37,129.22 99.4,130.25 SV1.4 | R10.1 57.41,95.94 | 57.41,95.94 52.42,95.94 v52.39,95.92
  Bottom 0.254: v72.41,107.3 v63.39,98.28 | v52.39,95.92 52.42,95.89 52.42,90.25 v51.5,89.34 | U$1.7/RX2 99.51,132.12 SV1.4
M3_OUTA  (via drill 0.2 pad 0.05)
  other vias: 51.25,105.62 51.25,104.86 50.49,104.86 51.25,104.1 50.49,104.1 49.73,104.1
  pour Top (no thermals): 51,113.12 51.76,113.12 51.76,103.97 50.49,102.7 48.96,102.7 48.96,103.97 51,106
  pour Bottom (no thermals): 48.96,102.7 50.49,102.7 51.76,103.97 51.76,108.67 51,108.67 51,106 48.96,103.97
M3_OUTB  (via drill 0.2 pad 0.05)
  other vias: 45.15,104.1 45.92,104.1 46.68,104.1 45.92,104.86 45.15,104.86 45.15,105.62
  pour Top (no thermals): 44.65,113.12 45.41,113.12 45.41,106 47.44,103.97 47.44,102.7 45.92,102.7 44.65,103.97
  pour Bottom (no thermals): 44.65,108.67 45.41,108.67 45.41,106 47.44,103.97 47.44,102.7 45.92,102.7 44.65,103.97
M3_PWM  (via drill 0.25)
  Top 0.254: R12.2 18.85,100.36 18.44,100.77 18.44,105.2 13.15,110.49 13.15,129.34 29.53,145.73 v31.18,145.73 | U$1.8/TX2 102.05,132.12 SV1.3
  Bottom 0.254: v31.18,145.73 101.19,145.73 102.05,144.87 U$1.8/TX2
M4_INA  (via drill 0.2)
  Top 0.254: 38.55,91.62 M4+.A 39.92,91.65 v39.95,91.62 | 43,95.31 61.28,95.31 v63.44,97.47 | v72.46,106.48 94.68,128.71 102.94,128.71 104.48,130.25 SV1.2 | R17.1 43,95.31 | v42.49,95.31 43,95.31
  Bottom 0.254: v63.44,97.47 v72.46,106.48 | v42.49,95.31 40.84,93.66 40.84,92.13 40.33,91.62 v39.95,91.62 | U$1.9 104.59,132.12 SV1.2
M4_INB  (via drill 0.2)
  Top 0.254: R18.1 40.84,94.67 | 40.84,94.67 40.84,90.23 39.95,89.34 38.55,89.34 M4-.A | 40.84,94.67 61.41,94.67 v63.44,96.7 | v72.46,105.72 94.94,128.2 104.97,128.2 107.02,130.25 SV1.1
  Bottom 0.254: v72.46,105.72 v63.44,96.7 | U$1.10/CS 107.13,132.12 SV1.1
M4_OUTA  (via drill 0.2 pad 0.05)
  other vias: 38.55,105.62 38.55,104.86 37.79,104.86 38.55,104.1 37.79,104.1 37.03,104.1
  pour Top (no thermals): 36.26,102.7 36.26,103.97 38.25,105.96 38.76,113.12 39.06,113.12 39.06,103.97 37.79,102.7
  pour Bottom (no thermals): 36.26,102.7 37.79,102.7 39.06,103.97 39.06,108.8 38.3,108.8 38.3,106 36.26,103.97
  pour Top (no thermals): 38.3,113.09 38.93,113.09 38.93,105.98 38.42,105.98 38.3,106.1
M4_OUTB  (via drill 0.2 pad 0.05)
  other vias: 32.45,105.62 32.45,104.86 33.22,104.86 33.98,104.1 33.22,104.1 32.45,104.1
  pour Top (no thermals): 31.95,103.97 31.95,113.12 32.71,113.12 32.71,106 34.74,103.97 34.74,102.7 33.22,102.7
  pour Bottom (no thermals): 31.95,108.8 32.71,108.8 32.71,106 34.74,103.97 34.74,102.7 33.22,102.7 31.95,103.97
M4_PWM  (via drill 0.25)
  Top 0.254: R20.2 20.23,102.64 19.18,103.69 v19.18,103.94 | v75.89,145.11 75.91,145.14 108.38,145.14 U$1.11/MOSI
  Bottom 0.254: v19.18,103.94 19.18,105.34 12.72,111.8 12.72,128.33 29.5,145.11 v75.89,145.11 | U$1.11/MOSI 109.67,132.12 SV2.12
N$1  (via drill 0.35)
  Top 0.254: v166.95,58.48 166.92,58.45 L_SW2.C
  Bottom 0.254: R_SW2.2 166.92,58.45 v166.95,58.48
N$2  (via drill 0.35)
  Top 0.254: L_SW1.C 156.76,58.45 v156.79,58.48
  Bottom 0.254: v156.79,58.48 156.76,58.45 R_SW1.2
N$3  (via drill 0.35)
  Top 0.254: L_SW3.C 177.08,58.45 v177.11,58.48
  Bottom 0.254: v177.11,58.48 177.08,58.45 R_SW3.2
N$4  (via drill 0.25)
  Top 0.254: LED4.A v182.82,80.83
  Bottom 0.254: v182.82,80.83 R4.2
N$6
  Top 0.254: C4.1 123.64,44.79 124.91,46.06 IC1.5
N$7  (via drill 0.35)
  Top 0.254: v104.08,18.09 104.15,18.16 L_BAT.A
  Bottom 0.254: R_BAT.2 104.14,18.15 v104.08,18.09
N$8
  Top 0.254: L_BALL.C 161.07,159.7 R_BALL.2
N$9  (via drill 0.35)
  Top 0.254: L_MOT.A 96.15,18.16 v96.21,18.22
  Bottom 0.254: v96.21,18.22 96.14,18.15 R_MOT.1
N$10
  Top 0.254: C9.1 R3.2 R2.2 IC1.6
N$11
  Top 0.254: IC1.2 R1.2
N$12  (via drill 0.35)
  Top 0.254: v118.94,18.22 120.69,18.22 L_ELETT.A
  Bottom 0.254: R_ELETT.1 118.97,18.19 v118.94,18.22
N$18  (via drill 0.25)
  Top 0.254: LED2.A v172.66,80.83
  Bottom 0.254: v172.66,80.83 R25.2
N$19  (via drill 0.25)
  Top 0.254: v177.74,80.83 LED3.A
  Bottom 0.254: R24.2 v177.74,80.83
N$20  (via drill 0.25)
  Top 0.254: v167.58,80.83 LED1.A
  Bottom 0.254: R26.2 v167.58,80.83
N$21
  Top 0.254: R7.1 32.55,142.93 | 32.55,142.93 32.55,141.44 33.34,140.65 34.48,140.65 M1-.C | M1+.C 32.65,142.83 32.55,142.93
N$22  (via drill 0.2 pad 0.38)
  Top 0.254: v33.6,121.34 DRV1.3 | R5.2 40.84,131.12 41.11,130.85 v41.11,130.36
  Bottom 0.254: v41.11,130.36 41.11,122.56 40.24,121.7 33.95,121.7 v33.6,121.34
N$23  (via drill 0.2 pad 0.38)
  Top 0.254: R6.2 43,131.38 v41.6,129.98 | v37.41,120.96 DRV1.6
  Bottom 0.254: v37.41,120.96 37.61,121.16 40.54,121.16 41.6,122.22 v41.6,129.98
N$24  (via drill 0.2 pad 0.38)
  Top 0.254: R8.1 54.52,136.33 v44.65,136.33 | v37.41,122.99 DRV1.11
  Bottom 0.254: v44.65,136.33 40.58,132.26 40.58,122.99 39.82,122.23 38.17,122.23 v37.41,122.99
N$25  (via drill 0.2 pad 0.38)
  Top 0.254: v50.11,111.06 DRV3.3 | R9.2 55.28,102.42 51.89,102.42 51.15,101.68 43.48,101.68 42.55,102.62 v42.55,103.56
  Bottom 0.254: v42.55,103.56 42.55,109.34 43.25,110.04 49.09,110.04 v50.11,111.06
N$26  (via drill 0.2 pad 0.38)
  Top 0.254: R10.2 55.35,100.51 52.01,100.51 51.38,101.15 43.25,101.15 42.06,102.34 v42.06,103.05 | v46.3,111.06 DRV3.6
  Bottom 0.254: v42.06,103.05 42.06,109.74 43,110.67 45.92,110.67 v46.3,111.06
N$27
  Top 0.254: R11.1 44.46,89.34 | 44.46,89.34 44.46,91.06 45.15,91.75 46.74,91.75 M3+.C | M3-.C 44.49,89.37 44.46,89.34
N$28  (via drill 0.2 pad 0.38)
  Top 0.254: R12.1 31.66,100.36 32.45,101.15 39.15,101.15 v39.19,101.11 | v46.3,108.26 DRV3.11
  Bottom 0.254: v39.19,101.11 41.18,101.11 43.12,103.05 43.12,108.9 43.63,109.4 45.79,109.4 46.3,108.9 v46.3,108.26
N$29  (via drill 0.2 pad 0.38)
  Top 0.254: R13.2 52.68,131.53 51.89,130.74 43.33,130.74 v42.15,129.56 | v46.3,120.83 DRV2.3
  Bottom 0.254: v42.15,129.56 42.15,122.19 43.25,121.09 46.17,121.09 46.3,120.96 v46.3,120.83
N$30  (via drill 0.2 pad 0.38)
  Top 0.254: 54.72,129.22 R14.2 52.87,129.25 52.01,130.11 43.54,130.11 v42.63,129.2 | DRV2.6 v50.11,121.22
  Bottom 0.254: v42.63,129.2 42.63,122.59 43.63,121.6 49.85,121.6 50.11,121.34 v50.11,121.22
N$31
  Top 0.254: R15.1 45.76,142.93 | 45.76,142.93 45.76,141.44 46.68,140.52 47.82,140.52 M2-.C | M2+.C 45.86,142.83 45.76,142.93
N$32  (via drill 0.2 pad 0.38)
  Top 0.254: R16.1 52.62,133.82 50.71,135.72 45.01,135.72 v45.01,135.72 | v50.11,122.99 DRV2.11
  Bottom 0.254: v45.01,135.72 43.12,133.83 43.12,122.99 43.88,122.23 49.35,122.23 v50.11,122.99
N$33  (via drill 0.2 pad 0.38)
  Top 0.254: v41.58,102.67 41.58,102.06 43,100.64 R17.2 | v37.41,111.03 DRV4.3
  Bottom 0.254: v37.41,111.03 37.74,110.7 40.62,110.7 41.58,109.75 v41.58,102.67
N$34  (via drill 0.2 pad 0.38)
  Top 0.254: R18.2 40.84,101.28 41.09,101.53 v41.09,102.29 | v33.6,111.06 DRV4.6
  Bottom 0.254: v41.09,102.29 41.09,109.4 40.33,110.17 34.49,110.17 v33.6,111.06
N$35
  Top 0.254: R19.1 33.03,89.21 | 33.03,89.21 33.03,90.93 33.75,91.65 M4+.C | M4-.C 33.18,89.37 33.03,89.21
N$36  (via drill 0.2 pad 0.38)
  Top 0.254: R20.1 31.41,102.64 31.44,102.67 32.39,101.72 40.39,101.72 v40.58,101.91 | v33.6,108.52 DRV4.11
  Bottom 0.254: v40.58,101.91 40.58,109.02 40.07,109.53 34.61,109.53 v33.6,108.52
N$79
  Top 0.254: SV6.12 U$1.VIN
N_IN
  Top 0.254: SV6.5 U$1.19/A5/SCL
  Bottom 0.254: LS_N.2 85.92,185.65 85.92,174.81 87.32,173.41 96.08,173.41 96.97,172.52 SV6.5
N_OUT
  Top 0.254: SV6.4 U$1.18/A4/SDA
  Bottom 0.254: LS_N.3 87.81,175.08 88.84,174.05 97.73,174.05 99.51,172.27 SV6.4
PWB_1
  Top 0.254: U$1.39/A15/(MISO1) SV3.7
  Bottom 0.254: BALL_MUX.10 123.23,155.92 122.37,156.78 U$1.39/A15/(MISO1)
PWB_2
  Top 0.254: U$1.38/A14/(CS1) SV3.6
  Bottom 0.254: BALL_MUX.11 125.39,157.19 124.91,157.66 U$1.38/A14/(CS1)
PWB_3  (via drill 0.25)
  Top 0.254: v154.37,157.16 127.96,157.16 127.45,157.66 U$1.37/CS SV3.5
  Bottom 0.254: BALL_MUX.14 154.34,157.19 v154.37,157.16
PWB_4  (via drill 0.25)
  Top 0.254: v154.37,158.43 154.37,158.3 153.87,157.79 130.4,157.79 129.99,158.2 U$1.36/CS SV3.4
  Bottom 0.254: BALL_MUX.13 154.34,158.46 v154.37,158.43
PWR_B1
  Top 0.406: S4.3 11.5,141.16 9.21,142.07 | S3.3 30.17,176.24 | S2.3 63.7,199.22 | S1.3 102.43,207.86 | RB1.2 47.62,182.78 CB1.1 46.17,186.57 46.17,189.57
  pour Top (no thermals): 103.19,206.39 103.19,208.36 arc69 8.11,141.53 9.64,140.93 arc-69
PWR_B2
  Top 0.406: S5.3 2.36,102.45 | S6.3 10.74,63.46 | S7.3 33.72,31.07 | S8.3 66.87,9.74 | RB2.2 44.73,27.42 CB2.1 44.7,23.38 43.76,22.44
  pour Top (no thermals): 3.34,103.18 1.64,103.18 arc69 67.4,8.82 67.92,10.21 arc-69
PWR_B3
  Top 0.406: S12.3 200.6,66.89 | S11.3 179.14,32.98 | S10.3 145.99,10.37 | S9.3 107.51,2.12 | RB3.2 153.94,23.17 CB3.1 155.24,19.64 162.63,19.64
  pour Top (no thermals): 106.75,2.97 106.75,1.45 arc69 201.36,67.49 199.85,67.96 arc-69
PWR_B4  (via drill 0.35 pad 0.38)
  Top 0.254: v152.6,193.48 152.6,196.4
  Top 0.406: S16.3 142.06,200.49 | S15.3 175.71,179.28 | S14.3 198.44,146.77 | S13.3 208.09,107.53
  Bottom 0.254: RB4.2 152.53,190.63 CB4.1 152.57,193.45 v152.6,193.48
  pour Top (no thermals): 206.82,106.61 208.6,106.61 arc69 141.67,201.73 140.91,200.21 arc-69
R_DIG  (via drill 0.25, 0.35)
  Top 0.254: ROLL.3 42.63,65.73 44.9,68 v63.57,68 | v110.94,127.82 121.1,127.82 122.26,128.98 SV2.7
  Bottom 0.254: v63.57,68 63.57,68.13 72.59,77.15 72.59,104.96 95.45,127.82 v110.94,127.82 | U$1.26/A12/MOSI1 122.37,132.12 SV2.7
R_PWM  (via drill 0.25)
  Top 0.254: SV6.9 86.81,162.11 | 86.81,162.11 U$1.23/A9 | v85.67,162.11 86.81,162.11
  Bottom 0.254: ROLL.2 44.63,61.13 43.12,59.62 34.24,59.62 17.8,76.06 17.8,105.97 12.21,111.56 12.21,128.71 41,157.5 41.16,157.66 45.61,162.11 v85.67,162.11
S_IN
  Top 0.254: SV6.1 U$1.15/A1/RX3
  Bottom 0.254: LS_S.2 113.75,181.3 107.13,174.68 SV6.1
S_OUT
  Top 0.254: SV3.12 U$1.14/A0/TX3
  Bottom 0.254: LS_S.3 115.75,180.63 109.67,174.56 SV3.12
SCL  (via drill 0.25)
  Top 0.254: R21.1 103.09,104.48 v103.07,104.45
  Bottom 0.254: U$3.SCL 101.92,104.45 | 101.92,104.45 101.92,105.21 117.18,120.47 117.18,131.63 | 117.18,131.63 SV2.9 | v103.07,104.45 101.92,104.45 | U$1.24/A10/TX6/SCL2 117.29,131.74 117.18,131.63
SDA  (via drill 0.25)
  Top 0.254: R22.1 105.13,102.19 v105.1,102.17
  Bottom 0.254: U$3.SDA 104.46,102.17 | 104.46,102.17 104.46,106.92 119.83,122.29 119.83,131.9 | 119.83,131.9 SV2.8 | v105.1,102.17 104.46,102.17 | U$1.25/A11/RX6/SDA2 119.83,131.9
SW1  (via drill 0.25)
  Top 0.254: SW1.2 151.83,67.65 | L_SW1.A 151.86,67.62 151.83,67.65 | v145.74,68.89 146.98,67.65 151.83,67.65 | v145.74,75.37 v145.74,128.84
  Bottom 0.254: v145.74,128.84 133.93,128.84 132.42,130.34 SV2.3 132.53,132.12 U$1.30 | v145.74,68.89 v145.74,75.37
SW2  (via drill 0.25)
  Top 0.254: SW2.2 161.99,67.65 | L_SW2.A 162.02,67.62 161.99,67.65 | v158.82,68.89 160.06,67.65 161.99,67.65 | v158.82,75.24 157.93,76.13 147.77,76.13 146.75,77.15 v146.75,129.6
  Bottom 0.254: v146.75,129.6 135.71,129.6 134.94,130.36 134.94,131.63 | 134.94,131.63 134.94,131.99 SV2.2 | v158.82,68.89 v158.82,75.24 | U$1.31 135.07,131.76 134.94,131.63
SW3  (via drill 0.25)
  Top 0.254: SW3.2 172.15,67.65 | 172.15,67.65 170.25,67.65 169.01,68.89 v168.98,68.89 | v147.77,130.36 147.77,77.53 148.53,76.77 167.4,76.77 v168.93,75.24 | L_SW3.A 172.18,67.62 172.15,67.65
  Bottom 0.254: v147.77,130.36 138.12,130.36 137.48,130.99 137.48,131.63 | 137.48,131.63 137.48,131.99 SV2.1 | v168.98,68.89 168.98,75.19 v168.93,75.24 | U$1.32 137.61,131.76 137.48,131.63
V-  (via drill 0.2, 0.2 pad 0.3, 0.25, 0.25 pad 0.05, 0.25 pad 0.38, 0.35 pad 0.55)
  other vias: 54.81,107.02 54.81,106 54.81,108.04 54.81,108.92 56.33,108.92 56.33,108.04 56.33,107.02 56.33,106 56.84,123.78 55.57,123.78 54.3,123.78 54.3,124.8 55.57,124.8 56.84,124.8 41.34,119.72 41.85,119.72 42.36,119.72 41.34,119.21 41.85,119.21 42.36,119.21 41.34,112.61 41.85,112.61 42.36,112.61 42.36,112.1 41.85,112.1 41.34,112.1 29.15,108.16 29.15,107.02 27.88,108.16 27.88,107.02 26.61,107.02 26.61,108.16 97.61,51.78 98.88,51.78 100.15,51.78 101.42,51.78 102.69,51.78 97.61,50.51 98.88,50.51 100.15,50.51 101.42,50.51 102.69,49.24 102.69,50.51 102.69,47.97 101.42,49.24 101.42,47.97 100.15,49.24 100.15,47.97 98.88,49.24 98.88,47.97 97.61,49.24 97.61,47.97 26.87,124.8 28.14,124.8 29.41,124.8 29.41,123.78 28.14,123.78 26.87,123.78
  pour Top (no thermals): 21.28,115.91 21.28,111.85 23.31,109.81 23.31,106.77 24.07,106 31.44,106 31.44,113.12 30.68,113.12 28.64,111.08 27.37,111.08 22.55,115.91
  pour Top (no thermals): 39.57,113.12 39.57,106 44.14,106 44.14,113.12
  pour Top (no thermals): 39.57,125.82 39.57,118.7 44.14,118.7 44.14,125.82
  pour Top (no thermals): 52.27,125.82 52.27,118.7 52.77,118.7 54.81,120.74 57.09,120.74 59.63,123.28 71.06,123.28 71.06,125.82
  pour Top (no thermals): 30.68,118.7 31.44,118.7 31.44,125.82 21.28,125.82 21.28,123.28 22.55,123.28 25.09,120.74 29.41,120.74 30.68,119.47
  pour Top (no thermals): 96.46,43.52 104.08,43.52 104.08,53.17 96.46,53.17
  pour Bottom (no thermals): 62.17,54.82 62.17,125.82 52.27,125.82 52.27,118.7 51.76,118.2 44.39,118.2 44.14,118.45 44.14,120.23 39.57,120.23 39.57,118.45 39.31,118.2 31.69,118.2 31.44,118.45 31.44,125.82 21.28,125.82 21.28,105.75 31.44,105.75 31.44,113.12 31.95,113.62 39.31,113.62 39.57,113.37 39.57,111.59 44.14,111.59 44.14,113.12 44.65,113.62 53.16,113.62 53.16,51.52 54.92,49.76
  pour Top (no thermals): 52.27,113.12 52.27,105.12 57.85,105.12 57.85,111.08 53.03,111.08 53.03,113.12
  pour Bottom: 52.27,114.13 57.85,114.13 57.85,105.12 52.27,105.12
  pour Bottom (no thermals): 61.16,123.28 71.19,123.28 71.19,125.94 61.16,125.94
  pour Bottom (no thermals): 73.48,61.17 73.48,59.9 63.82,59.9 62.17,58.25 61.03,58.25 61.03,62.57 62.43,62.57 63.82,61.17
  pour Bottom (no thermals): 96.46,43.52 104.08,43.52 104.08,53.17 96.46,53.17
  pour Bottom (no thermals): 96.84,47.58 79.7,47.58 78.17,49.11 76.02,49.11 74.36,47.46 57.09,47.46 54.3,50.25 60.52,56.47 62.17,56.47 62.17,50.25 63.57,48.85 73.86,48.85 78.17,53.17 96.84,53.17
VBAT
  Bottom 0.254: R_BAT.1 112.77,22.59 112.77,27.77 BAT_CON.+
  pour Top (no thermals): 89.86,34.63 89.86,31.58 90.11,31.33 104.59,31.33 105.1,30.82 110.94,30.82 111.45,31.33 125.16,31.33 125.42,31.58 125.42,34.63
  pour Bottom (no thermals): 89.86,34.63 89.86,31.58 90.11,31.33 104.59,31.33 105.1,30.82 110.94,30.82 111.45,31.33 125.16,31.33 125.42,31.58 125.42,34.63
VMOT  (via drill 0.35)
  Top 0.254: v68.14,28.76 66.87,27.49 66.87,26.98 75.63,18.22 v89.48,18.22
  Bottom 0.254: R_MOT.2 91.89,18.22 v89.48,18.22
  pour Top (no thermals): 95.19,27.52 95.95,28.28 95.95,30.06 95.19,30.82 75.25,30.82 71.06,35.01 71.06,42.76 73.09,44.79 71.06,46.82 71.06,55.46 73.09,57.49 71.06,59.52 71.06,121.24 69.54,121.24 69.54,119.21 62.17,119.21 62.17,121.24 60.65,121.24 60.65,119.21 56.08,119.21 56.08,120.23 54.81,120.23 52.77,118.2 49.22,118.2 49.22,125.82 48.46,125.82 48.46,121.5 47.19,120.23 47.19,118.2 36.52,118.2 36.52,125.82 35.76,125.82 35.76,121.5 34.49,120.23 34.49,118.2 29.66,118.2 29.15,118.7 29.15,120.23 27.63,120.23 27.63,119.47 22.8,119.47 22.8,121.24 18.23,121.24 18.23,106 22.8,106 22.8,109.81 20.77,111.85 20.77,116.42 22.55,116.42 27.37,111.59 28.64,111.59 30.68,113.62 34.49,113.62 34.49,106 35.25,106 35.25,110.07 36.52,111.34 36.52,113.62 47.19,113.62 47.19,106 47.95,106 47.95,110.32 49.22,111.59 49.22,113.62 54.81,113.62 54.81,111.59 56.33,111.59 56.33,113.62 65.47,113.62 65.47,29.8 67.76,27.52
  pour Top: 108.65,41.11 108.65,46.57 114.24,46.57 114.24,35.9 113.48,35.14 70.05,35.14 69.79,35.39 69.79,39.84 107.38,39.84
  pour Top (no thermals): 63.95,119.21 63.95,113.37 65.35,111.97 66.36,111.97 71.06,116.67 71.06,119.21
W_IN
  Top 0.254: SV3.9 U$1.41/A17
  Bottom 0.254: LS_W.2 127.72,184.38 117.29,173.95 SV3.9
W_OUT
  Top 0.254: SV3.8 U$1.40/A16
  Bottom 0.254: LS_W.3 129.72,183.97 119.83,174.08 SV3.8

## Text on the board
tPlace: VIN | GND | 3V3 | ROLLER2 | KICKER2 | TX_CAM | RX_CAM | N_IN | N_OUT | E_IN | E_OUT | S_IN | S_OUT | BALL_IN | GND | W_IN | W_OUT | GND | 3V3 | GND | NC | NC | GND | GND
bPlace: Designed by Siria Sannino, be creative c: | JLCJLCJLC
tNames: MUX1 | MUX2 | MUX3 | MUX4 | RX_BT | TX_BT | BALL_OUT | M1_INA | M1_INB | M1_PWM | M2_INA | M2_INB | M2_PWM | M3_INA | M3_INB | M3_PWM | M4_INA | M4_INB | M4_PWM | BUZZER | SCL | SDA | ROLLER1 | KICKER1 | TX_ARDU | RX_ARDU | SW1 | SW2 | SW3 | 3V3